# EAGLE schematic EBR01 (EAGLE 7.3.0)
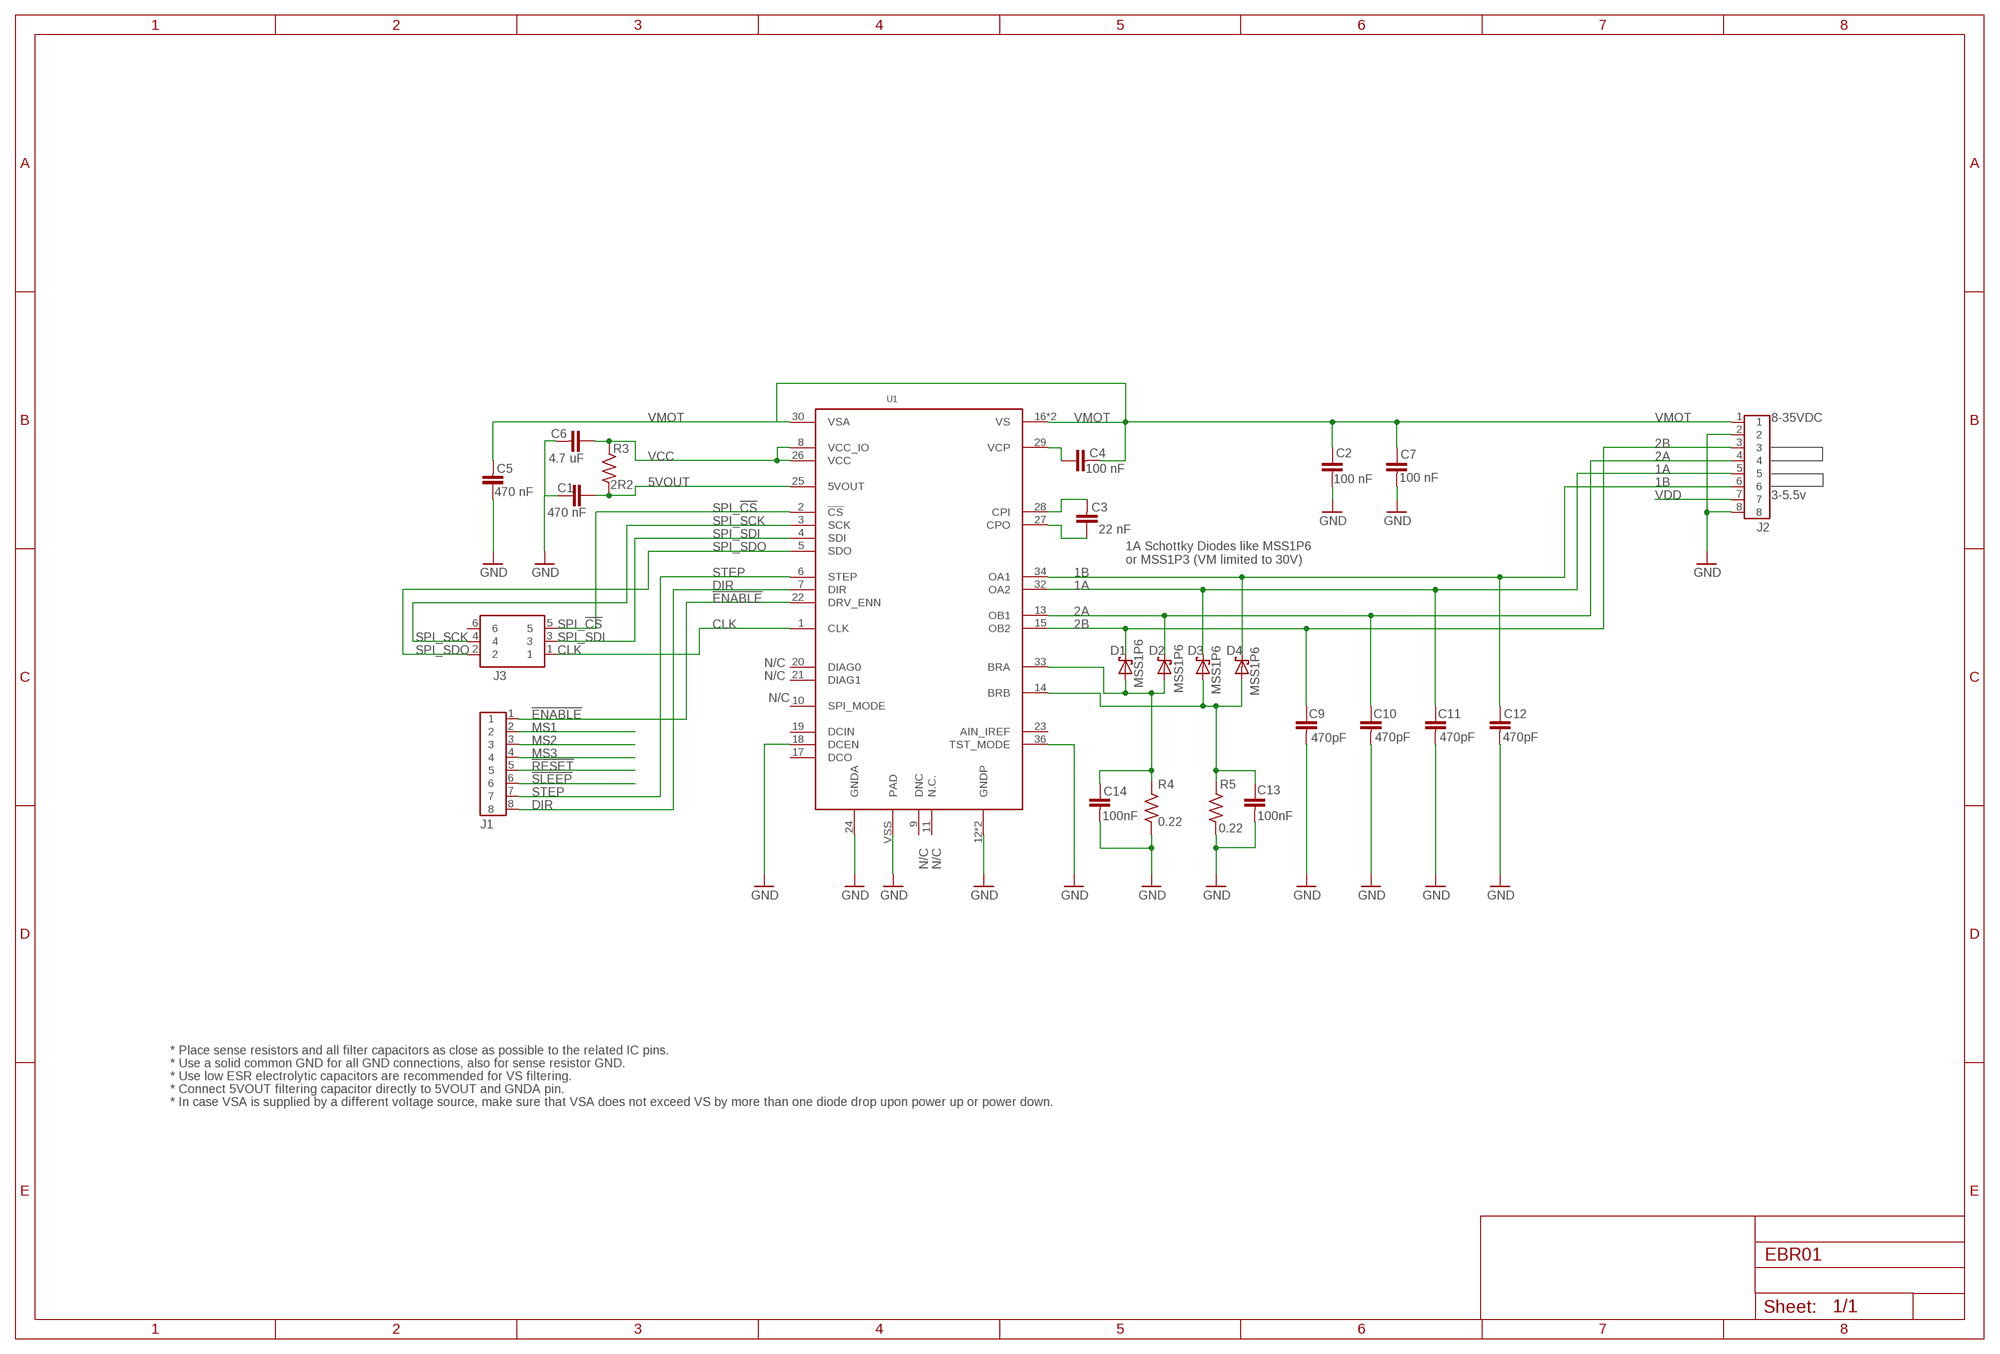
[diagram p0: schematic, sheet 1]

## Parts
C1  470 nF  CAP0603-CAP  [0603-CAP]
C2  100 nF  CPL-CAP-X7R-0603-100NF-50V  [C0603]
C3  22 nF  CPL-CAP-X7R-0603-22NF-50VKEMETC0603C223K5RAC  [C0603]
C4  100 nF  CPL-CAP-X7R-0603-100NF-50V  [C0603]
C5  470 nF  CPL-CAP-X7R-0603-470NF-16V  [C0603]
C6  4.7 uF  CPL-CAP-X5R-4.7UF-10V  [C0603]
C7  100 nF  CPL-CAP-X7R-0603-100NF-50V  [C0603]
C9  470pF  CPL-CAP-X7R-0603-470PF-100V  [C0603]
C10  470pF  CPL-CAP-X7R-0603-470PF-100V  [C0603]
C11  470pF  CPL-CAP-X7R-0603-470PF-100V  [C0603]
C12  470pF  CPL-CAP-X7R-0603-470PF-100V  [C0603]
C13  100nF  CPL-CAP-X7R-0603-100NF-50V  [C0603]
C14  100nF  CPL-CAP-X7R-0603-100NF-50V  [C0603]
D1  MSS1P6  CPL-DIO-MSS1P6-MICROSMP  [MICRO-SMP]
D2  MSS1P6  CPL-DIO-MSS1P6-MICROSMP  [MICRO-SMP]
D3  MSS1P6  CPL-DIO-MSS1P6-MICROSMP  [MICRO-SMP]
D4  MSS1P6  CPL-DIO-MSS1P6-MICROSMP  [MICRO-SMP]
J1  CPL-CON-HEADER-0.1IN-8P-M  [CON-HDR-8POS-MALE]
J2  CPL-CON-HEADER-0.1IN-8P-M  [CON-HDR-8POS-MALE]
J3  CPL-CON-HEADER-0.1IN-2X3P-M  [CON-HDR-2X3P]
R3  2R2  CPL-RES-0603-2.2-0.25W  [R0603]
R4  0.22  CPL-RES-1206-0.22-0.5W  [R1206]
R5  0.22  CPL-RES-1206-0.22-0.5W  [R1206]
U1  CPL-MDR-2PHSTEPPER  [QFN36-(5X6)]

## Nets
1A: C11.1 D3.NEG(C) J2.5 U1.32(OA2)
1B: C12.1 D4.NEG(C) J2.6 U1.34(OA1)
2A: C10.1 D2.NEG(C) J2.4 U1.13(OB1)
2B: C9.1 D1.NEG(C) J2.3 U1.15(OB2)
5VOUT: C1.1 R3.1 U1.25(5VOUT)
!ENABLE!: J1.1 U1.22(DRV_ENN)
!RESET!: J1.5
!SLEEP!: J1.6
CLK: J3.1 U1.1(CLK)
DIR: J1.8 U1.7(DIR)
GND: C1.2 C2.2 C5.1 C6.2 C7.2 C9.2 C10.2 C11.2 C12.2 C13.2 C14.2 J2.2 J2.8 R4.1 R5.1 U1.12(GNDP) U1.18(DCEN) U1.24(GNDA) U1.35(GNDP) U1.36(TST_MODE) U1.VSS(PAD)
MS1: J1.2
MS2: J1.3
MS3: J1.4
N$1: C3.2 U1.28(CPI)
N$3: C14.1 D1.POS(A) D2.POS(A) R4.2 U1.33(BRA)
N$4: C13.1 D3.POS(A) D4.POS(A) R5.2 U1.14(BRB)
N$5: C3.1 U1.27(CPO)
N$8: C4.1 U1.29(VCP)
SPI_!CS!: J3.5 U1.2(!CS)
SPI_SCK: J3.4 U1.3(SCK)
SPI_SDI: J3.3 U1.4(SDI)
SPI_SDO: J3.2 U1.5(SDO)
STEP: J1.7 U1.6(STEP)
VCC: C6.1 R3.2 U1.8(VCC_IO) U1.26(VCC)
VDD: J2.7
VMOT: C2.1 C4.2 C5.2 C7.1 J2.1 U1.16(VS) U1.30(VSA) U1.31(VS)
Unconnected: J3.6 U1.9(DNC) U1.10(SPI_MODE) U1.11(N.C.) U1.17(DCO) U1.19(DCIN) U1.20(DIAG0) U1.21(DIAG1) U1.23(AIN_IREF)

## Notes on the sheet
- 8-35VDC
- 3-5.5v
- 1A Schottky Diodes like MSS1P6
  or MSS1P3 (VM limited to 30V)
- N/C
- N/C
- N/C
- N/C | N/C
- * Place sense resistors and all filter capacitors as close as possible to the related IC pins.
- * Use a solid common GND for all GND connections, also for sense resistor GND.
- * Use low ESR electrolytic capacitors are recommended for VS filtering.
- * Connect 5VOUT filtering capacitor directly to 5VOUT and GNDA pin.
- * In case VSA is supplied by a different voltage source, make sure that VSA does not exceed VS by more than one diode drop upon power up or power down.

## Library data of the parts
C1 = SparkFun-Capacitors:CAP: Capacitor Standard 0603 ceramic capacitor, and 0.1" leaded capacitor.
C2 C4 C7 C13 C14 = TinWhiskers:CPL-CAP-X7R-0603-100NF-50V: Capacitor: 100nF, 50V, 10%; Package: 0603
C3 = TinWhiskers:CPL-CAP-X7R-0603-22NF-50V: Capacitor Specs: 22nF, 50V, 10%, Package: 0603
C5 = TinWhiskers:CPL-CAP-X7R-0603-470NF-16V: Ceramic Capacitor (0603), 410 nF, 16V, 10%; Based on Kemet C0603C474K4RAC; Datasheet: http://www.mouser.com/ds/2/212/KEM_C1002_X7R_SMD-357932.pdf
C6 = TinWhiskers:CPL-CAP-X5R-4.7UF-10V: Capacitor: 4.7uF, 10V, 10% Package: 0603; Datasheet: http://www.yuden.co.jp/productdata/catalog/en/mlcc_all_e.pdf
C9-C12 = TinWhiskers:CPL-CAP-X7R-0603-470PF-100V: Capacitor: 470pF, 100V, 5%; Package: 0603 Datasheet: http://www.mouser.com/ds/2/427/vjw1bcbascomseries-223529.pdf
D1-D4 = TinWhiskers:CPL-DIO-MSS1P6-MICROSMP: Diode: Rectifier, 1A, 60V; Package: Micro-SMP; Datasheet: http://www.vishay.com/docs/89018/mss1p6.pdf
J1 J2 = TinWhiskers:CPL-CON-HEADER-0.1IN-8P-M
J3 = TinWhiskers:CPL-CON-HEADER-0.1IN-2X3P-M: Connector: 0.1" Pitch, 2x3P Datasheet: http://www.mouser.com/ds/2/418/NG_CD_825440_G_baseFilename-672958.pdf
R3 = TinWhiskers:CPL-RES-0603-2.2-0.25W: Resistor, 2.2 Ohm, 0.25w, 1% Package: 0603 Datasheet: http://www.mouser.com/ds/2/427/dcrcwe3-109170.pdf
R4 R5 = TinWhiskers:CPL-RES-1206-0.22-0.5W: Resistor: 0.22 Ohm, 0.5W, 1%, 100 ppm/C Package: 1206 Datasheet: http://www.mouser.com/ds/2/427/rcwe-244377.pdf
U1 = TinWhiskers:CPL-MDR-2PHSTEPPER: Stepper Driver (Trinamic TMC2130-LA)